# Altium schematic sheet ui-top.SchDoc
size A4; SheetNumber: 1; SheetTotal: 5
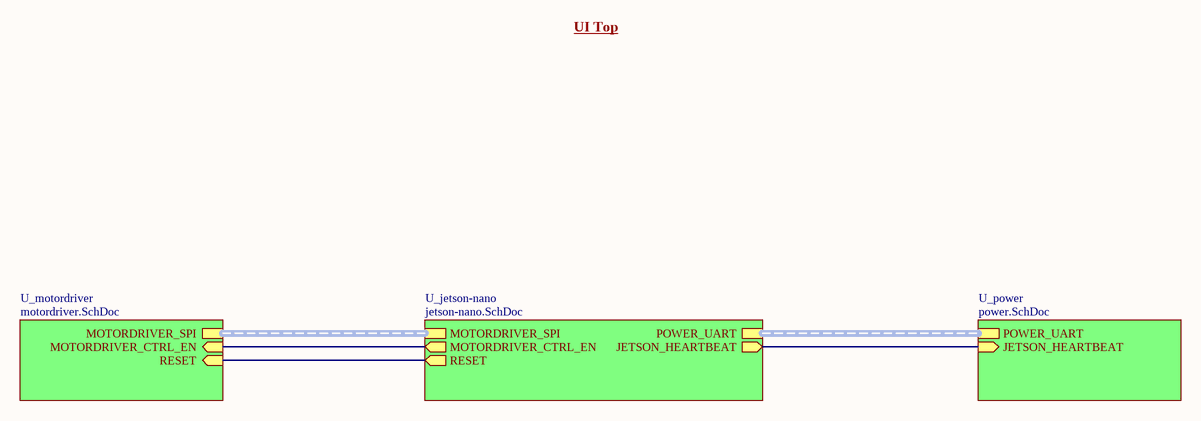
[diagram p0: ui-top.SchDoc]

## Sub-sheets
U_jetson-nano = jetson-nano.SchDoc: MOTORDRIVER_SPI (harness MOTORDRIVER_SPI), POWER_UART (harness POWER_UART), JETSON_HEARTBEAT (out), MOTORDRIVER_CTRL_EN (out), RESET (out)
U_motordriver = motordriver.SchDoc: MOTORDRIVER_SPI (harness MOTORDRIVER_SPI), MOTORDRIVER_CTRL_EN (in), RESET (in)
U_power = power.SchDoc: POWER_UART (harness POWER_UART), JETSON_HEARTBEAT (in)

## Nets
(unnamed): sheet U_jetson-nano/JETSON_HEARTBEAT, sheet U_power/JETSON_HEARTBEAT
(unnamed): sheet U_jetson-nano/MOTORDRIVER_CTRL_EN, sheet U_motordriver/MOTORDRIVER_CTRL_EN
(unnamed): sheet U_jetson-nano/RESET, sheet U_motordriver/RESET

## Buses and harness runs
harness sheet U_jetson-nano/MOTORDRIVER_SPI = sheet U_motordriver/MOTORDRIVER_SPI
harness sheet U_jetson-nano/POWER_UART = sheet U_power/POWER_UART

## Notes on the sheet
- UI Top